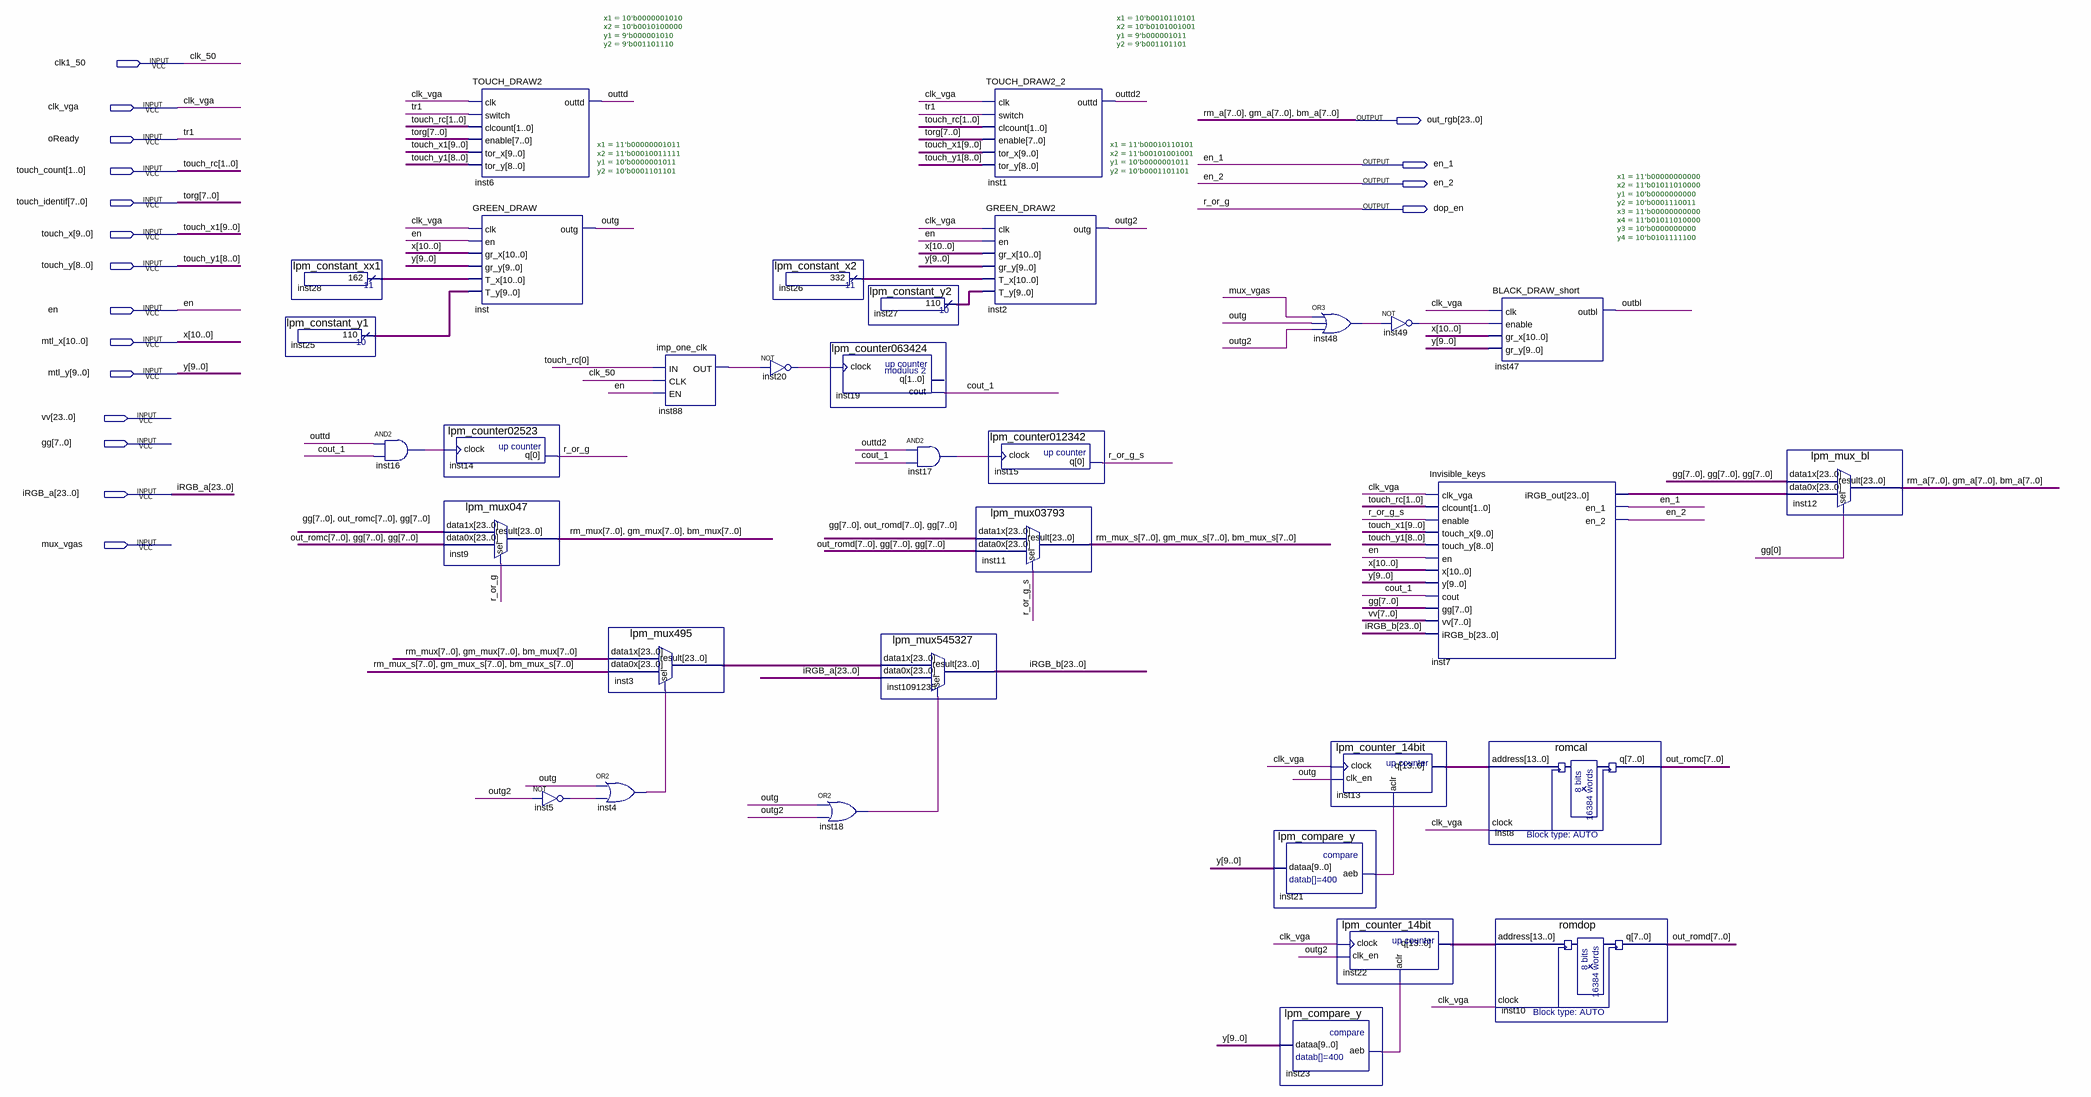
[diagram p0: schematic sheet]
// Quartus schematic keys_2.bdf as structural Verilog: 33 symbols, 18 pins
module keys_2 (
  input  clk1_50,
  input  clk_vga,
  input  oReady,
  input  [1:0] touch_count,
  input  [7:0] touch_identif,
  input  [9:0] touch_x,
  input  [8:0] touch_y,
  input  en,
  input  [10:0] mtl_x,
  input  [9:0] mtl_y,
  input  [23:0] vv,
  input  [7:0] gg,
  input  [23:0] iRGB_a,
  input  mux_vgas,
  output [23:0] out_rgb,
  output en_1,
  output en_2,
  output dop_en
);

  wire cout_1, inst4_out, inst5_out, inst16_out, inst17_out, inst18_out, inst20_out, inst21_aeb, inst23_aeb,
       inst48_out, inst49_out, inst88_out, outbl, outg, outg2, outtd, outtd2, r_or_g_s;
  wire [7:0] bm_mux, bm_mux_s, gm_mux, gm_mux_s, out_romc, out_romd, rm_mux, rm_mux_s;
  wire [9:0] inst25_result, inst27_result;
  wire [10:0] inst26_result, inst28_result;
  wire [13:0] inst13_q, inst22_q;
  wire [23:0] inst3_result, inst7_irgb_out, iRGB_b;

  lpm_constant_xx1 inst28 (.result(inst28_result));
  lpm_constant_y1 inst25 (.result(inst25_result));
  and inst16 (inst16_out, outtd, cout_1);
  TOUCH_DRAW2 #(.x1(10'b0000001010), .x2(10'b0010100000), .y1(9'b000001010), .y2(9'b001101110)) inst6 (
    .clk(clk_vga), .switch(oReady), .clcount(touch_count), .enable(touch_identif), .tor_x(touch_x),
    .tor_y(touch_y), .outtd(outtd));
  GREEN_DRAW #(.x1(11'b00000001011), .x2(11'b00010011111), .y1(10'b0000001011), .y2(10'b0001101101)) inst (
    .clk(clk_vga), .en(en), .gr_x(mtl_x), .gr_y(mtl_y), .T_x(inst28_result), .T_y(inst25_result), .outg(outg));
  lpm_counter02523 inst14 (.clock(inst16_out), .q(dop_en));
  lpm_mux047 inst9 (
    .data1x({gg, out_romc, gg}), .data0x({out_romc, gg, gg}), .sel(dop_en), .result({rm_mux, gm_mux, bm_mux}));
  not inst5 (inst5_out, outg2);
  lpm_mux495 inst3 (
    .data1x({rm_mux, gm_mux, bm_mux}), .data0x({rm_mux_s, gm_mux_s, bm_mux_s}), .sel(inst4_out),
    .result(inst3_result));
  or inst4 (inst4_out, outg, inst5_out);
  imp_one_clk inst88 (.IN(touch_count[0]), .CLK(clk1_50), .EN(en), .OUT(inst88_out));
  lpm_constant_x2 inst26 (.result(inst26_result));
  not inst20 (inst20_out, inst88_out);
  lpm_counter063424 inst19 (.clock(inst20_out), .cout(cout_1));  // open: q
  or inst18 (inst18_out, outg, outg2);
  lpm_constant_y2 inst27 (.result(inst27_result));
  lpm_mux545327 inst1091235 (.data1x(inst3_result), .data0x(iRGB_a), .sel(inst18_out), .result(iRGB_b));
  and inst17 (inst17_out, outtd2, cout_1);
  TOUCH_DRAW2_2 #(.x1(10'b0010110101), .x2(10'b0101001001), .y1(9'b000001011), .y2(9'b001101101)) inst1 (
    .clk(clk_vga), .switch(oReady), .clcount(touch_count), .enable(touch_identif), .tor_x(touch_x),
    .tor_y(touch_y), .outtd(outtd2));
  GREEN_DRAW2 #(.x1(11'b00010110101), .x2(11'b00101001001), .y1(10'b0000001011), .y2(10'b0001101101)) inst2 (
    .clk(clk_vga), .en(en), .gr_x(mtl_x), .gr_y(mtl_y), .T_x(inst26_result), .T_y(inst27_result), .outg(outg2));
  lpm_mux03793 inst11 (
    .data1x({gg, out_romd, gg}), .data0x({out_romd, gg, gg}), .sel(r_or_g_s),
    .result({rm_mux_s, gm_mux_s, bm_mux_s}));
  lpm_counter012342 inst15 (.clock(inst17_out), .q(r_or_g_s));
  lpm_compare_y inst21 (.dataa(mtl_y), .aeb(inst21_aeb));
  lpm_compare_y inst23 (.dataa(mtl_y), .aeb(inst23_aeb));
  or inst48 (inst48_out, mux_vgas, outg, outg2);
  lpm_counter_14bit inst13 (.clock(clk_vga), .clk_en(outg), .aclr(inst21_aeb), .q(inst13_q));
  lpm_counter_14bit inst22 (.clock(clk_vga), .clk_en(outg2), .aclr(inst23_aeb), .q(inst22_q));
  not inst49 (inst49_out, inst48_out);
  Invisible_keys inst7 (
    .clk_vga(clk_vga), .clcount(touch_count), .enable(r_or_g_s), .touch_x(touch_x), .touch_y(touch_y),
    .en(en), .x(mtl_x), .y(mtl_y), .cout(cout_1), .gg(gg), .vv(vv[7:0]), .iRGB_b(iRGB_b),
    .iRGB_out(inst7_irgb_out), .en_1(en_1), .en_2(en_2));
  BLACK_DRAW_short #(.x1(11'b00000000000), .x2(11'b01011010000), .y1(10'b0000000000), .y2(10'b0001110011), .x3(11'b00000000000), .x4(11'b01011010000), .y3(10'b0000000000), .y4(10'b0101111100)) inst47 (
    .clk(clk_vga), .enable(inst49_out), .gr_x(mtl_x), .gr_y(mtl_y), .outbl(outbl));
  romcal inst8 (.address(inst13_q), .clock(clk_vga), .q(out_romc));
  romdop inst10 (.address(inst22_q), .clock(clk_vga), .q(out_romd));
  lpm_mux_bl inst12 (.data1x({gg, gg, gg}), .data0x(inst7_irgb_out), .sel(gg[0]), .result(out_rgb));

  // Other names for the same wires on the sheet: bm_a[7:0] = out_rgb[7:0]; clk_50 = clk1_50;
  //   gm_a[7:0] = out_rgb[15:8]; r_or_g = dop_en; rm_a[7:0] = out_rgb[23:16]; torg[7:0] = touch_identif;
  //   touch_rc[1:0] = touch_count; touch_x1[9:0] = touch_x; touch_y1[8:0] = touch_y; tr1 = oReady; x[10:0] = mtl_x;
  //   y[9:0] = mtl_y
endmodule
